# Altium schematic sheet new_JTAG_to_HDMI.SchDoc
size A4; SheetNumber: 1; SheetTotal: 1
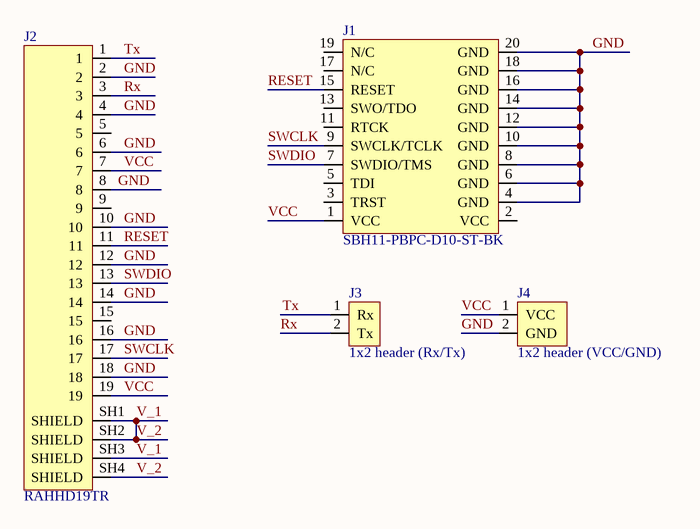
[diagram p0: new_JTAG_to_HDMI.SchDoc]

## Parts
J1  SBH11-PBPC-D10-ST-BK  [SBH11-PBPC-D10-ST-BK]
J2  RAHHD19TR  [SWITCHCRAFT_RAHHD19TR]
J3  1x2 header (Rx/Tx)  [DS1021-1*2SF1-1]
J4  1x2 header (VCC/GND)  [DS1021-1*2SF1-1]

## Nets
GND: J1.4(GND) J1.6(GND) J1.8(GND) J1.10(GND) J1.12(GND) J1.14(GND) J1.16(GND) J1.18(GND) J1.20(GND) J2.2 J2.4 J2.6 J2.8 J2.10 J2.12 J2.14 J2.16 J2.18 J4.2(GND)
RESET: J1.15(RESET) J2.11
Rx: J2.3 J3.2(Tx)
SWCLK: J1.9(SWCLK/TCLK) J2.17
SWDIO: J1.7(SWDIO/TMS) J2.13
Tx: J2.1 J3.1(Rx)
V_1: J2.SH1(SHIELD) J2.SH2(SHIELD) J2.SH3(SHIELD) J2.SH4(SHIELD)  [also labelled V_2]
VCC: J1.1(VCC) J2.7 J2.19 J4.1(VCC)

Not connected (* = marked no-connect by the designer): J1 2(VCC) 3(TRST) 5(TDI) 11(RTCK) 13(SWO/TDO) 17(N/C) 19(N/C); J2 5 9 15

## Library data of the parts
J1 = SBH11-PBPC-D10-ST-BK: Conn Shrouded Header (4 Sides) HDR 20 POS 2.54mm Solder ST Top Entry Thru-Hole; Manufacturer: Sullins; Supplier: Digikey; Supplier Part Number: S9172-ND; Manufacturer Part Number: SBH11-PBPC-D10-ST-BK; RoHS: Yes; Category: Connectors; Stock: 20189; Pricing: 1=0,65, 10=0,496, 80=0,38963, 440=0,32211, 945=0,29663, 4900=0,25024, 10000=0,2457 (USD); ComponentLink1URL: https://datasheet.ciiva.com/730/sbh11-pbpc-dxx-st-xx-730919.pdf?src-supplier=Digikey; ComponentLink1Description: https://datasheet.ciiva.com/730/sbh11-pbpc-dxx-st-xx-730919.pdf?src-supplier=Digikey; ComponentLink2Description: Chipdip link; ComponentLink2URL: https://www.chipdip.ru/product0/8005812384; Supplier 1: https://www.chipdip.ru/product0/8005812384
J2 = RAHHD19TR: HDMI HDMI 2.0 Receptacle Connector 19 Position Surface Mount, Right Angle; Through Hole; MF: Switchcraft Inc.; Package: None; Price: None; Check_prices: https://www.snapeda.com/parts/RAHHD19TR/Switchcraft+%252F+Conxall/view-part/?ref=eda; Value: *; SnapEDA_Link: https://www.snapeda.com/parts/RAHHD19TR/Switchcraft+%252F+Conxall/view-part/?ref=snap; MP: RAHHD19TR; Availability: In Stock; Purchase-URL: https://pricing.snapeda.com/search/part/RAHHD19TR/?ref=eda; ComponentLink1Description: Chipdip link; ComponentLink1URL: https://www.chipdip.ru/product0/8007174530; Supplier 1: https://www.chipdip.ru/product0/8007174530
J3 = DS1021-1*2SF1-1_1: Manufacturer: Ningbo Connfly Electric; Supplier: Conrad; Supplier Part Number: 1390105; Manufacturer Part Number: DS1021-1*2SF1-1; RoHS: No; Pricing: 1=0,11 (EUR); ComponentLink1Description: Chipdip link; ComponentLink1URL: https://www.chipdip.ru/product0/8009330828; Supplier 1: https://www.chipdip.ru/product0/8009330828
J4 = DS1021-1*2SF1-1: Manufacturer: Ningbo Connfly Electric; Supplier: Conrad; Supplier Part Number: 1390105; Manufacturer Part Number: DS1021-1*2SF1-1; RoHS: No; Pricing: 1=0,11 (EUR); ComponentLink1Description: Chipdip link; ComponentLink1URL: https://www.chipdip.ru/product0/8009330828; Supplier 1: https://www.chipdip.ru/product0/8009330828